# Altium project MCH_MAIN.PrjPcb (part 3 of 3)

## Sheet MB_watchdog_mcu.SchDoc
size A3
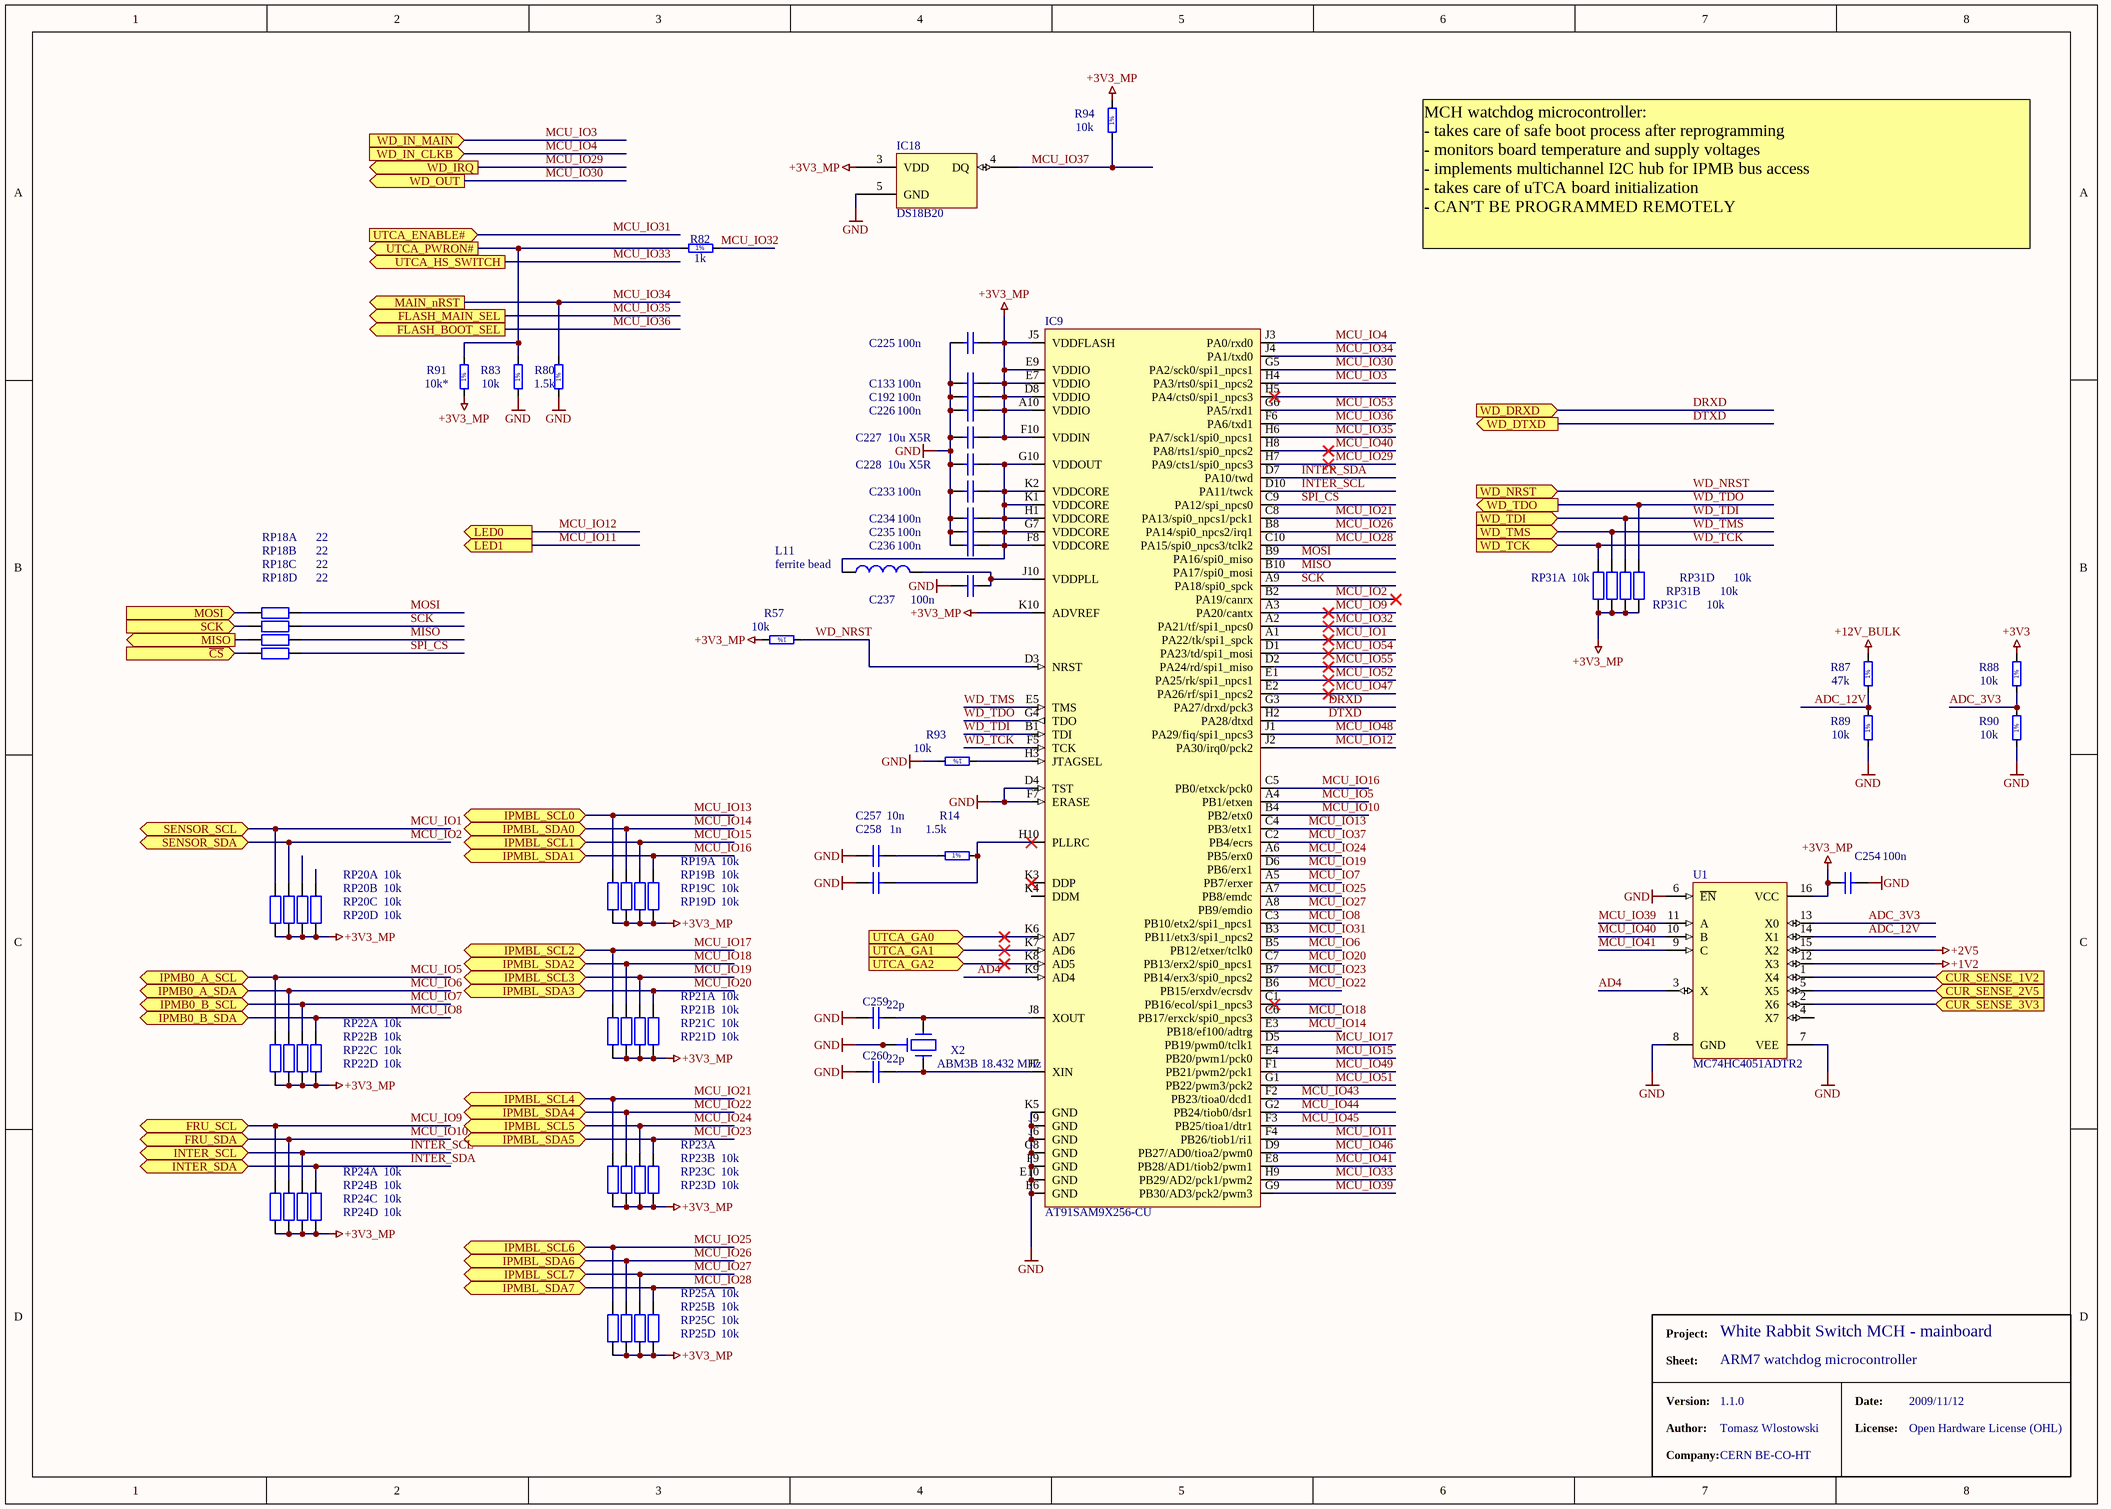
[diagram p9: MB_watchdog_mcu.SchDoc]

### Parts
C133  100n  [CAPC1005X55N]
C192  100n  [CAPC1005X55N]
C225  100n  [CAPC1005X55N]
C226  100n  [CAPC1005X55N]
C227  10u X5R  [CAPC1608X87N]
C228  10u X5R  [CAPC1608X87N]
C233  100n  [CAPC1005X55N]
C234  100n  [CAPC1005X55N]
C235  100n  [CAPC1005X55N]
C236  100n  [CAPC1005X55N]
C237  100n  [CAPC1005X55N]
C254  100n  [CAPC1005X55N]
C257  10n  [CAPC1005X55N]
C258  1n  [CAPC1005X55N]
C259  22p  [CAPC1005X55N]
C260  22p  [CAPC1005X55N]
IC9  AT91SAM9X256-CU  [TFBGA100x10]
IC18  DS18B20  [SOIC127P600-8AL]
L11  value ferrite bead  [INDC1608-0603]  (hidden comment: fer.bead)
R14  1.5k  [RESC1005X40N]
R57  10k  [RESC1005X40N]
R80  1.5k  [RESC1005X40N]
R82  1k  [RESC1005X40N]
R83  10k  [RESC1005X40N]
R87  47k  [RESC1005X40N]
R88  10k  [RESC1005X40N]
R89  10k  [RESC1005X40N]
R90  10k  [RESC1005X40N]
R91  10k*  [RESC1005X40N]
R93  10k  [RESC1005X40N]
R94  10k  [RESC1005X40N]
RP18  value 22  [YC124]  (hidden comment: 22R 0804)  (parts A,B,C,D of 4)
RP19  value 10k  [YC124]  (hidden comment: 10k 0804)  (parts A,B,C,D of 4)
RP20  value 10k  [YC124]  (hidden comment: 10k 0804)  (parts A,B,C,D of 4)
RP21  value 10k  [YC124]  (hidden comment: 10k 0804)  (parts A,B,C,D of 4)
RP22  value 10k  [YC124]  (hidden comment: 10k 0804)  (parts A,B,C,D of 4)
RP23  10k 0804  [YC124]  (value not drawn)  (parts A,B,C,D of 4)
RP24  value 10k  [YC124]  (hidden comment: 10k 0804)  (parts A,B,C,D of 4)
RP25  value 10k  [YC124]  (hidden comment: 10k 0804)  (parts A,B,C,D of 4)
RP31  value 10k  [YC124]  (hidden comment: 10k 0804)  (parts A,B,C,D of 4)
U1  MC74HC4051ADTR2  [948F-01]
X2  ABM3B 18.432 MHz  [XTALL_ABM3]

### Ports
CUR_SENSE_1V2 (in), CUR_SENSE_2V5 (in), CUR_SENSE_3V3 (in), FLASH_BOOT_SEL (out), FLASH_MAIN_SEL (out), FRU_SCL (bidir), FRU_SDA (bidir), INTER_SCL (bidir), INTER_SDA (bidir), IPMB0_A_SCL (bidir), IPMB0_A_SDA (bidir), IPMB0_B_SCL (bidir), IPMB0_B_SDA (bidir), IPMBL_SCL0 (bidir), IPMBL_SCL1 (bidir), IPMBL_SCL2 (bidir), IPMBL_SCL3 (bidir), IPMBL_SCL4 (bidir), IPMBL_SCL5 (bidir), IPMBL_SCL6 (bidir), IPMBL_SCL7 (bidir), IPMBL_SDA0 (bidir), IPMBL_SDA1 (bidir), IPMBL_SDA2 (bidir), IPMBL_SDA3 (bidir), IPMBL_SDA4 (bidir), IPMBL_SDA5 (bidir), IPMBL_SDA6 (bidir), IPMBL_SDA7 (bidir), LED0 (out), LED1 (out), MAIN_nRST (out), MISO (out), MOSI (in), SCK (in), SENSOR_SCL (bidir), SENSOR_SDA (bidir), UTCA_ENABLE# (in), UTCA_GA0 (in), UTCA_GA1 (in), UTCA_GA2 (in), UTCA_HS_SWITCH (out), UTCA_PWRON# (out), WD_DRXD (in), WD_DTXD (out), WD_IN_CLKB (in), WD_IN_MAIN (in), WD_IRQ (out), WD_NRST (in), WD_OUT (out), WD_TCK (in), WD_TDI (in), WD_TDO (out), WD_TMS (in), ~{CS} (in)

### Nets
+1V2: U1.12(X3)
+2V5: U1.15(X2)
+3V3: R88.2
+3V3_MP: C133.2 C192.2 C225.2 C226.2 C227.2 C254.1 IC9.A10(VDDIO) IC9.D8(VDDIO) IC9.E7(VDDIO) IC9.E9(VDDIO) IC9.F10(VDDIN) IC9.J5(VDDFLASH) IC9.K10(ADVREF) IC18.3(VDD) R57.2 R91.1 R94.2 RP19.1(A) RP19.2(A) RP19.3(A) RP19.4(A) RP20.1(A) RP20.2(A) RP20.3(A) RP20.4(A) RP21.1(A) RP21.2(A) RP21.3(A) RP21.4(A) RP22.1(A) RP22.2(A) RP22.3(A) RP22.4(A) RP23.1(A) RP23.2(A) RP23.3(A) RP23.4(A) RP24.1(A) RP24.2(A) RP24.3(A) RP24.4(A) RP25.1(A) RP25.2(A) RP25.3(A) RP25.4(A) RP31.1(A) RP31.2(A) RP31.3(A) RP31.4(A) U1.16(VCC)
+12V_BULK: R87.2
GND: C133.1 C192.1 C225.1 C226.1 C227.1 C228.1 C233.1 C234.1 C235.1 C236.1 C237.1 C254.2 C257.1 C258.1 C259.1 C260.1 IC9.D4(TST) IC9.E6(GND) IC9.E10(GND) IC9.F7(ERASE) IC9.F9(GND) IC9.G8(GND) IC9.J6(GND) IC9.J9(GND) IC9.K5(GND) IC18.5(GND) R80.1 R83.1 R89.1 R90.1 R93.2 U1.6(~{EN}) U1.7(VEE) U1.8(GND) X2.2 X2.4
AD4: IC9.K9(AD4) U1.3(X)
ADC_3V3: R88.1 R90.2 U1.13(X0)
ADC_12V: R87.1 R89.2 U1.14(X1)
CUR_SENSE_1V2: U1.1(X4) ; port CUR_SENSE_1V2
CUR_SENSE_2V5: U1.5(X5) ; port CUR_SENSE_2V5
CUR_SENSE_3V3: U1.2(X6) ; port CUR_SENSE_3V3
DRXD: IC9.G3(PA27/drxd/pck3) ; port WD_DRXD
DTXD: IC9.H2(PA28/dtxd) ; port WD_DTXD
INTER_SCL: IC9.D10(PA11/twck) RP24.5(B) ; port INTER_SCL
INTER_SDA: IC9.D7(PA10/twd) RP24.6(B) ; port INTER_SDA
MCU_IO1: IC9.A1(PA22/tk/spi1_spck) RP20.8(B) ; port SENSOR_SCL
MCU_IO2: IC9.B2(PA19/canrx) RP20.7(B) ; port SENSOR_SDA
MCU_IO3: IC9.H4(PA3/rts0/spi1_npcs2) ; port WD_IN_MAIN
MCU_IO4: IC9.J3(PA0/rxd0) ; port WD_IN_CLKB
MCU_IO5: IC9.A4(PB1/etxen) RP22.8(B) ; port IPMB0_A_SCL  [project net IPMB0_A_SCL]
MCU_IO6: IC9.B5(PB12/etxer/tclk0) RP22.7(B) ; port IPMB0_A_SDA  [project net IPMB0_A_SDA]
MCU_IO7: IC9.A5(PB7/erxer) RP22.6(B) ; port IPMB0_B_SCL  [project net IPMB0_B_SCL]
MCU_IO8: IC9.C3(PB10/etx2/spi1_npcs1) RP22.5(B) ; port IPMB0_B_SDA  [project net IPMB0_B_SDA]
MCU_IO9: IC9.A3(PA20/cantx) RP24.8(B) ; port FRU_SCL  [project net FRU_SCL]
MCU_IO10: IC9.B4(PB2/etx0) RP24.7(B) ; port FRU_SDA  [project net FRU_SDA]
MCU_IO11: IC9.F4(PB26/tiob1/ri1) ; port LED1  [project net FP_UTCA_LED1]
MCU_IO12: IC9.J2(PA30/irq0/pck2) ; port LED0  [project net FP_UTCA_LED0]
MCU_IO13: IC9.C4(PB3/etx1) RP19.8(B) ; port IPMBL_SCL0  [project net IPMBL_SCL0]
MCU_IO14: IC9.E3(PB18/ef100/adtrg) RP19.7(B) ; port IPMBL_SDA0  [project net IPMBL_SDA0]
MCU_IO15: IC9.E4(PB20/pwm1/pck0) RP19.6(B) ; port IPMBL_SCL1  [project net IPMBL_SCL1]
MCU_IO16: IC9.C5(PB0/etxck/pck0) RP19.5(B) ; port IPMBL_SDA1  [project net IPMBL_SDA1]
MCU_IO17: IC9.D5(PB19/pwm0/tclk1) RP21.8(B) ; port IPMBL_SCL2  [project net IPMBL_SCL2]
MCU_IO18: IC9.C6(PB17/erxck/spi0_npcs3) RP21.7(B) ; port IPMBL_SDA2  [project net IPMBL_SDA2]
MCU_IO19: IC9.D6(PB6/erx1) RP21.6(B) ; port IPMBL_SCL3  [project net IPMBL_SCL3]
MCU_IO20: IC9.C7(PB13/erx2/spi0_npcs1) RP21.5(B) ; port IPMBL_SDA3  [project net IPMBL_SDA3]
MCU_IO21: IC9.C8(PA13/spi0_npcs1/pck1) RP23.8(B) ; port IPMBL_SCL4  [project net IPMBL_SCL4]
MCU_IO22: IC9.B6(PB15/erxdv/ecrsdv) RP23.7(B) ; port IPMBL_SDA4  [project net IPMBL_SDA4]
MCU_IO23: IC9.B7(PB14/erx3/spi0_npcs2) RP23.5(B) ; port IPMBL_SDA5  [project net IPMBL_SDA5]
MCU_IO24: IC9.A6(PB5/erx0) RP23.6(B) ; port IPMBL_SCL5  [project net IPMBL_SCL5]
MCU_IO25: IC9.A7(PB8/emdc) RP25.8(B) ; port IPMBL_SCL6  [project net IPMBL_SCL6]
MCU_IO26: IC9.B8(PA14/spi0_npcs2/irq1) RP25.7(B) ; port IPMBL_SDA6  [project net IPMBL_SDA6]
MCU_IO27: IC9.A8(PB9/emdio) RP25.6(B) ; port IPMBL_SCL7  [project net IPMBL_SCL7]
MCU_IO28: IC9.C10(PA15/spi0_npcs3/tclk2) RP25.5(B) ; port IPMBL_SDA7  [project net IPMBL_SDA7]
MCU_IO29: IC9.H7(PA9/cts1/spi0_npcs3) ; port WD_IRQ
MCU_IO30: IC9.G5(PA2/sck0/spi1_npcs1) ; port WD_OUT
MCU_IO31: IC9.B3(PB11/etx3/spi1_npcs2) ; port UTCA_ENABLE#
MCU_IO32: IC9.A2(PA21/tf/spi1_npcs0) R82.2
MCU_IO33: IC9.H9(PB29/AD2/pck1/pwm2) ; port UTCA_HS_SWITCH  [project net FP_UTCA_HSWAPSW]
MCU_IO34: IC9.J4(PA1/txd0) R80.2 ; port MAIN_nRST  [project net MAIN_nRST]
MCU_IO35: IC9.H6(PA7/sck1/spi0_npcs1) ; port FLASH_MAIN_SEL  [project net FMAIN_SEL]
MCU_IO36: IC9.F6(PA6/txd1) ; port FLASH_BOOT_SEL  [project net FBOOT_SEL]
MCU_IO37: IC9.C2(PB4/ecrs) IC18.4(DQ) R94.1
MCU_IO39: IC9.G9(PB30/AD3/pck2/pwm3) U1.11(A)
MCU_IO40: IC9.H8(PA8/rts1/spi0_npcs2) U1.10(B)
MCU_IO41: IC9.E8(PB28/AD1/tiob2/pwm1) U1.9(C)
MCU_IO43: IC9.F2(PB23/tioa0/dcd1)
MCU_IO44: IC9.G2(PB24/tiob0/dsr1)
MCU_IO45: IC9.F3(PB25/tioa1/dtr1)
MCU_IO46: IC9.D9(PB27/AD0/tioa2/pwm0)
MCU_IO47: IC9.E2(PA26/rf/spi1_npcs2)
MCU_IO48: IC9.J1(PA29/fiq/spi1_npcs3)
MCU_IO49: IC9.F1(PB21/pwm2/pck1)
MCU_IO51: IC9.G1(PB22/pwm3/pck2)
MCU_IO52: IC9.E1(PA25/rk/spi1_npcs1)
MCU_IO53: IC9.G6(PA5/rxd1)
MCU_IO54: IC9.D1(PA23/td/spi1_mosi)
MCU_IO55: IC9.D2(PA24/rd/spi1_miso)
MISO: IC9.B10(PA17/spi0_mosi) RP18.6(B)
MOSI: IC9.B9(PA16/spi0_miso) RP18.8(B)
SCK: IC9.A9(PA18/spi0_spck) RP18.7(B)
SPI_CS: IC9.C9(PA12/spi_npcs0) RP18.5(B)
UTCA_GA0: IC9.K6(AD7) ; port UTCA_GA0
UTCA_GA1: IC9.K7(AD6) ; port UTCA_GA1
UTCA_GA2: IC9.K8(AD5) ; port UTCA_GA2
UTCA_PWRON#: R82.1 R83.2 R91.2 ; port UTCA_PWRON#
WD_CS: RP18.4(A) ; port ~{CS}
WD_MISO: RP18.3(A) ; port MISO
WD_MOSI: RP18.1(A) ; port MOSI
WD_NRST: IC9.D3(NRST) R57.1 ; port WD_NRST
WD_SCK: RP18.2(A) ; port SCK
WD_TCK: IC9.F5(TCK) RP31.8(B) ; port WD_TCK  [project net WD_JTAG_TCK]
WD_TDI: IC9.B1(TDI) RP31.5(B) ; port WD_TDI  [project net WD_JTAG_TDI]
WD_TDO: IC9.G4(TDO) RP31.7(B) ; port WD_TDO  [project net WD_JTAG_TDO]
WD_TMS: IC9.E5(TMS) RP31.6(B) ; port WD_TMS  [project net WD_JTAG_TMS]
NetC228_2: C228.2 C233.2 C234.2 C235.2 C236.2 IC9.F8(VDDCORE) IC9.G7(VDDCORE) IC9.G10(VDDOUT) IC9.H1(VDDCORE) IC9.K1(VDDCORE) IC9.K2(VDDCORE) L11.1
NetC237_2: C237.2 IC9.J10(VDDPLL) L11.2
NetC257_2: C257.2 R14.1
NetC258_2: C258.2 IC9.H10(PLLRC) R14.2
NetC259_2: C259.2 IC9.J8(XOUT) X2.1
NetC260_2: C260.2 IC9.J7(XIN) X2.3
NetIC9_H3: IC9.H3(JTAGSEL) R93.1

Not connected (* = marked no-connect by the designer): IC9 C1(PB16/ecol/spi1_npcs3)* H5(PA4/cts0/spi1_npcs3)* K3(DDP)* K4(DDM); RP20 5(B) 6(B); U1 4(X7)

### Notes on the sheet
- !
- MCH watchdog microcontroller:
  - takes care of safe boot process after reprogramming
  - monitors board temperature and supply voltages
  - implements multichannel I2C hub for IPMB bus access
  - takes care of uTCA board initialization
  - CAN'T BE PROGRAMMED REMOTELY
- Project:
- Sheet:
- ARM7 watchdog microcontroller
- White Rabbit Switch MCH - mainboard
- Version:
- Author:
- Company:
- 1.1.0
- Tomasz Wlostowski
- CERN BE-CO-HT
- Date:
- License:
- 2009/11/12
- Open Hardware License (OHL)
- (in symbol R0402_1K5_1%_0.0625W_100PPM) 1%
- (in symbol R0402_1K_1%_0.0625W_100PPM) 1%
- (in symbol R0402_10K_1%_0.0625W_100PPM) 1%
- (in symbol R0402_47K_1%_0.0625W_100PPM) 1%

### Library data of the parts
C133 C192 C225 C226 C233-C237 C254 = CC0402_100NF_16V_10%_X7R: Non-polarised capacitor; Part Description: SMD Multilayer Chip Ceramic Capacitor; Manufacturer: GENERIC; Manufacturer1 Part Number: 223878715649; Manufacturer1 Datasheet: \\cern.ch\dfs\Applications\Altium\Datasheets\CC0402_X7R_PHYCOMP.pdf; Value: 100nF; Voltage: 16V; TC: X7R; Tolerance: ±10%; Table: Capacitors SMD; Part Number: CC0402_100NF_16V_10%_X7R; Component Kind: Standard; Component Type: Standard; Designator: Capacitor - non polarized; Library Reference: Capacitor - non polarized; Pin Count: 2; Status: Not Recommended; Manufacturer Part Number: CC0402_100NF_16V_10%_X7R; Case: 0402; Mounted: Yes; Socket: No; SMD: Yes; Manufacturer1 Example: PHYCOMP; Manufacturer1 ComponentHeight: 0.55mm; HelpURL: \\cern.ch\dfs\Applications\Altium\Datasheets\CC0402_X7R_PHYCOMP.pdf; Author: CERN DEM JLC; CreateDate: 12/3/2007; LatestRevisionDate: 12/3/2007
C227 C228 = CC0603_10UF_6.3V_20%_X5R: Non-polarised capacitor; Part Description: SMD Multilayer Chip Ceramic Capacitor; Manufacturer: GENERIC; Manufacturer1 Part Number: C0603C106M9PAC; Manufacturer1 Datasheet: \\cern.ch\dfs\Applications\Altium\Datasheets\CC0603_X5R_KEMET.pdf; Value: 10uF; Voltage: 6.3V; Tolerance: ±20%; Table: Capacitors SMD; Part Number: CC0603_10UF_6.3V_20%_X5R; Component Kind: Standard; Component Type: Standard; Designator: Capacitor - non polarized; Library Reference: Capacitor - non polarized; Pin Count: 2; Status: Preferred; TC: X5R; Manufacturer Part Number: CC0603_10uF_6.3V_20%_X5R; Case: 0603; Mounted: Yes; Socket: No; SMD: Yes; Manufacturer1 Example: KEMET; Manufacturer1 ComponentHeight: 0.95mm; HelpURL: \\cern.ch\dfs\Applications\Altium\Datasheets\CC0603_X5R_KEMET.pdf; Author: CERN DEM JLC; CreateDate: 2007-12-03; LatestRevisionDate: 2007-12-03
C257 = CC0402_10NF_16V_10%_X7R: Non-polarised capacitor; Part Description: SMD Multilayer Chip Ceramic Capacitor; Manufacturer: GENERIC; Manufacturer1 Part Number: 223878715636; Manufacturer1 Datasheet: \\cern.ch\dfs\Applications\Altium\Datasheets\CC0402_X7R_PHYCOMP.pdf; Value: 10nF; Voltage: 16V; TC: X7R; Tolerance: ±10%; Table: Capacitors SMD; Part Number: CC0402_10NF_16V_10%_X7R; Component Kind: Standard; Component Type: Standard; Designator: Capacitor - non polarized; Library Reference: Capacitor - non polarized; Pin Count: 2; Status: Not Recommended; Manufacturer Part Number: CC0402_10NF_16V_10%_X7R; Case: 0402; Mounted: Yes; Socket: No; SMD: Yes; Manufacturer1 Example: PHYCOMP; Manufacturer1 ComponentHeight: 0.55mm; HelpURL: \\cern.ch\dfs\Applications\Altium\Datasheets\CC0402_X7R_PHYCOMP.pdf; Author: CERN DEM JLC; CreateDate: 2007-12-03; LatestRevisionDate: 2007-12-03
C258 = CC0402_1NF_50V_10%_X7R: Non-polarised capacitor; Part Description: SMD Multilayer Chip Ceramic Capacitor; Manufacturer: GENERIC; Manufacturer1 Part Number: 223858715623; Manufacturer1 Datasheet: \\cern.ch\dfs\Applications\Altium\Datasheets\CC0402_X7R_PHYCOMP.pdf; Value: 1nF; Voltage: 50V; TC: X7R; Tolerance: ±10%; Table: Capacitors SMD; Part Number: CC0402_1NF_50V_10%_X7R; Component Kind: Standard; Component Type: Standard; Designator: Capacitor - non polarized; Library Reference: Capacitor - non polarized; Pin Count: 2; Status: Not Recommended; Manufacturer Part Number: CC0402_1NF_50V_10%_X7R; Case: 0402; Mounted: Yes; Socket: No; SMD: Yes; Manufacturer1 Example: PHYCOMP; Manufacturer1 ComponentHeight: 0.55mm; HelpURL: \\cern.ch\dfs\Applications\Altium\Datasheets\CC0402_X7R_PHYCOMP.pdf; Author: CERN DEM JLC; CreateDate: 2007-12-03; LatestRevisionDate: 2007-12-03
C259 C260 = CC0402_22PF_50V_5%_NP0: Non-polarised capacitor; Part Description: SMD Multilayer Chip Ceramic Capacitor; Manufacturer: GENERIC; Manufacturer1 Part Number: 223886915229; Manufacturer1 Datasheet: \\cern.ch\dfs\Applications\Altium\Datasheets\CC0402_NP0_PHYCOMP.pdf; Value: 22pF; Voltage: 50V; TC: NP0; Tolerance: ±5%; Table: Capacitors SMD; Part Number: CC0402_22PF_50V_5%_NP0; Component Kind: Standard; Component Type: Standard; Designator: Capacitor - non polarized; Library Reference: Capacitor - non polarized; Pin Count: 2; Status: Not Recommended; Manufacturer Part Number: CC0402_22PF_50V_5%_NP0; Case: 0402; Mounted: Yes; Socket: No; SMD: Yes; Manufacturer1 Example: PHYCOMP; Manufacturer1 ComponentHeight: 0.55mm; HelpURL: \\cern.ch\dfs\Applications\Altium\Datasheets\CC0402_NP0_PHYCOMP.pdf; Author: CERN DEM JLC; CreateDate: 2007-12-03; LatestRevisionDate: 2007-12-03
IC9 = AT91SAM7X256: Atmel ARM7 microcontroller with 256kB flash; RefId: Mouser/556-A91SAM7X256CU
IC18 = DS18B20Z: 1-wire thermometer/ID chip; RefId: 1379772; Value: DS18B20Z; Supplier: Farnell
L11 = Inductor: Ferrite bead; Published: 8-Jun-2000; Revision: July-2002: Re-released for DXP Platform.; Publisher: Altium Limited
R14 = R0402_1K5_1%_0.0625W_100PPM: Resistor - 1%; Part Description: General Purpose Thick Film Chip Resistor; Manufacturer: GENERIC; Manufacturer1 Part Number: 232270671502; Manufacturer1 Datasheet: \\cern.ch\dfs\Applications\Altium\Datasheets\R0402_Phycomp_RC0402.pdf; Value: 1k5; TC: ±100ppm/°C; Table: Resistors SMD; Part Number: R0402_1K5_1%_0.0625W_100PPM; Component Kind: Standard; Component Type: Standard; Designator: Resistor - 1%; Library Reference: Resistor - 1%; Pin Count: 2; Status: Not recommended; Power: 0.0625W; Tolerance: ±1%; Manufacturer Part Number: R0402_1K5_1%_0.0625W_100PPM; Case: 0402; Mounted: Yes; Socket: No; SMD: Yes; Manufacturer1 Example: PHYCOMP; Manufacturer1 ComponentHeight: 0.4mm; HelpURL: \\cern.ch\dfs\Applications\Altium\Datasheets\R0402_Phycomp_RC0402.pdf; Author: CERN DEM JLC; CreateDate: 2007-12-03; LatestRevisionDate: 2008-03-13
R57 R83 R88-R90 R93 R94 = R0402_10K_1%_0.0625W_100PPM: as R103-R108 on sheet MB_power_supply; Part Number: R0402_10K_1%_0.0625W_100PPM; Component Kind: Standard; Component Type: Standard; Designator: Resistor - 1%; Library Reference: Resistor - 1%; Pin Count: 2; Value: 10k; Status: Not recommended; Power: 0.0625W; Tolerance: ±1%; Manufacturer Part Number: R0402_10K_1%_0.0625W_100PPM; Case: 0402; Mounted: Yes; Socket: No; SMD: Yes; Manufacturer1 Example: PHYCOMP; Manufacturer1 ComponentHeight: 0.4mm; HelpURL: \\cern.ch\dfs\Applications\Altium\Datasheets\R0402_Phycomp_RC0402.pdf; Author: CERN DEM JLC; CreateDate: 12/3/2007; LatestRevisionDate: 3/13/2008
R80 R91 = R0402_10K_1%_0.0625W_100PPM: Resistor - 1%; Part Description: General Purpose Thick Film Chip Resistor; Manufacturer: GENERIC; Manufacturer1 Part Number: 232270671003; Manufacturer1 Datasheet: \\cern.ch\dfs\Applications\Altium\Datasheets\R0402_Phycomp_RC0402.pdf; Value: 10k; TC: ±100ppm/°C; Table: Resistors SMD; Part Number: R0402_10K_1%_0.0625W_100PPM; Component Kind: Standard; Component Type: Standard; Designator: Resistor - 1%; Library Reference: Resistor - 1%; Pin Count: 2; Status: Not recommended; Power: 0.0625W; Tolerance: ±1%; Manufacturer Part Number: R0402_10K_1%_0.0625W_100PPM; Case: 0402; Mounted: Yes; Socket: No; SMD: Yes; Manufacturer1 Example: PHYCOMP; Manufacturer1 ComponentHeight: 0.4mm; HelpURL: \\cern.ch\dfs\Applications\Altium\Datasheets\R0402_Phycomp_RC0402.pdf; Author: CERN DEM JLC; CreateDate: 12/3/2007; LatestRevisionDate: 3/13/2008
R82 = R0402_1K_1%_0.0625W_100PPM: Resistor - 1%; Part Description: General Purpose Thick Film Chip Resistor; Manufacturer: GENERIC; Manufacturer1 Part Number: 232270671002; Manufacturer1 Datasheet: \\cern.ch\dfs\Applications\Altium\Datasheets\R0402_Phycomp_RC0402.pdf; TC: ±100ppm/°C; Table: Resistors SMD; Part Number: R0402_1K_1%_0.0625W_100PPM; Component Kind: Standard; Component Type: Standard; Designator: Resistor - 1%; Library Reference: Resistor - 1%; Pin Count: 2; Value: 1k; Status: Not recommended; Power: 0.0625W; Tolerance: ±1%; Manufacturer Part Number: R0402_1K_1%_0.0625W_100PPM; Case: 0402; Mounted: Yes; Socket: No; SMD: Yes; Manufacturer1 Example: PHYCOMP; Manufacturer1 ComponentHeight: 0.4mm; HelpURL: \\cern.ch\dfs\Applications\Altium\Datasheets\R0402_Phycomp_RC0402.pdf; Author: CERN DEM JLC; CreateDate: 2007-12-03; LatestRevisionDate: 2008-03-13
R87 = R0402_47K_1%_0.0625W_100PPM: Resistor - 1%; Part Description: General Purpose Thick Film Chip Resistor; Manufacturer: GENERIC; Manufacturer1 Part Number: 232270675103; Manufacturer1 Datasheet: \\cern.ch\dfs\Applications\Altium\Datasheets\R0402_Phycomp_RC0402.pdf; TC: ±100ppm/°C; Table: Resistors SMD; Part Number: R0402_47K_1%_0.0625W_100PPM; Component Kind: Standard; Component Type: Standard; Designator: Resistor - 1%; Library Reference: Resistor - 1%; Pin Count: 2; Value: 47k; Status: Not recommended; Power: 0.0625W; Tolerance: ±1%; Manufacturer Part Number: R0402_47K_1%_0.0625W_100PPM; Case: 0402; Mounted: Yes; Socket: No; SMD: Yes; Manufacturer1 Example: PHYCOMP; Manufacturer1 ComponentHeight: 0.4mm; HelpURL: \\cern.ch\dfs\Applications\Altium\Datasheets\R0402_Phycomp_RC0402.pdf; Author: CERN DEM JLC; CreateDate: 12/3/2007; LatestRevisionDate: 3/13/2008
RP18 = Res_Pack4_22R_YC124: 4-resistor pack; RefId: AVX  CRB2A4 series; Supplier: Farnell
RP19-RP25 RP31 = Res_Pack4_10k_YC124: 4-resistor pack; RefId: AVX  CRB2A4 series; Supplier: Farnell
U1 = MC74HC4051ADTR2: Analog Multiplexer/Demultiplexer; Published: 17-Jul-2002; LatestRevisionDate: 06-Jun-2005; LatestRevisionNote: Stylized 3D Model Added; DatasheetVersion: Mar-2000; PackageVersion: Mar-2000; PackageReference: 948F-01; Publisher: Altium Limited; PackageDescription: Shrink Small Outline; 16 Leads; Body Width 4.4 mm; Pitch 0.65 mm; ComponentLink1Description: Manufacturer Link; ComponentLink1URL: http://www.onsemi.com/site/products/parametrics/0,4446,47,00.html; ComponentLink2Description: Datasheet; ComponentLink2URL: http://www.onsemi.com/pub/Collateral/MC74HC4051A-D.PDF
X2 = X_CRYSTAL_SMD_ABM8: Miniature crystal oscillator (ABRACON); Value: ABM3B-18.432MHZ-B2-T; RefId: 1611814; Supplier: Farnell

## Nets that join several sheets
+1V2: MB_power_supply (6 pins), MB_watchdog_mcu (U1.12)
+2V5: MB_main (8 pins), MB_power_supply (19 pins), MB_watchdog_mcu (U1.15)
+3V3: MB_main (23 pins), MB_CPU_memory (43 pins), MB_power_supply (28 pins), MB_clocking (18 pins), MB_watchdog_mcu (R88.2)
+3V3_MP: MB_main (CN2.4 R92.1), MB_watchdog_mcu (50 pins)
+12V_BACKPLANE: MB_main (8 pins), MB_power_supply (F1.1)
+12V_BULK: MB_main (CN5.1 CN5.2 CN5.3 CN5.4), MB_power_supply (24 pins), MB_watchdog_mcu (R87.2)
GND: MB_main (113 pins), MB_CPU_memory (37 pins), MB_power_supply (89 pins), MB_clocking (15 pins), MB_watchdog_mcu (36 pins)
CUR_SENSE_1V2: MB_power_supply (IC21.6), MB_watchdog_mcu (U1.1)
CUR_SENSE_2V5: MB_power_supply (IC22.6), MB_watchdog_mcu (U1.5)
CUR_SENSE_3V3: MB_power_supply (IC24.6), MB_watchdog_mcu (U1.2)
DRXD: MB_main (CN7.15), MB_watchdog_mcu (IC9.G3)
DTXD: MB_main (CN7.13), MB_watchdog_mcu (IC9.H2)
FBOOT_SEL: MB_CPU_memory (IC8.1), MB_watchdog_mcu (IC9.F6)
FP_UTCA_HSWAPSW: MB_main (R92.2 S1.B S1.D), MB_watchdog_mcu (IC9.H9)
FP_UTCA_LED0: MB_main (RP30.8), MB_watchdog_mcu (IC9.J2)
FP_UTCA_LED1: MB_main (RP30.7), MB_watchdog_mcu (IC9.F4)
FRU_SCL: MB_main (CN2.130), MB_watchdog_mcu (IC9.A3 RP24.8)
FRU_SDA: MB_main (CN2.129), MB_watchdog_mcu (IC9.B4 RP24.7)
INTER_SCL: MB_main (CN2.56), MB_watchdog_mcu (IC9.D10 RP24.5)
INTER_SDA: MB_main (CN2.71), MB_watchdog_mcu (IC9.D7 RP24.6)
IPMB0_A_SCL: MB_main (CN2.127), MB_watchdog_mcu (IC9.A4 RP22.8)
IPMB0_A_SDA: MB_main (CN2.126), MB_watchdog_mcu (IC9.B5 RP22.7)
IPMB0_B_SCL: MB_main (CN2.124), MB_watchdog_mcu (IC9.A5 RP22.6)
IPMB0_B_SDA: MB_main (CN2.123), MB_watchdog_mcu (IC9.C3 RP22.5)
IPMBL_SCL0: MB_main (CN2.121), MB_watchdog_mcu (IC9.C4 RP19.8)
IPMBL_SCL1: MB_main (CN2.118), MB_watchdog_mcu (IC9.E4 RP19.6)
IPMBL_SCL2: MB_main (CN2.115), MB_watchdog_mcu (IC9.D5 RP21.8)
IPMBL_SCL3: MB_main (CN2.112), MB_watchdog_mcu (IC9.D6 RP21.6)
IPMBL_SCL4: MB_main (CN2.109), MB_watchdog_mcu (IC9.C8 RP23.8)
IPMBL_SCL5: MB_main (CN2.106), MB_watchdog_mcu (IC9.A6 RP23.6)
IPMBL_SCL6: MB_main (CN2.103), MB_watchdog_mcu (IC9.A7 RP25.8)
IPMBL_SCL7: MB_main (CN2.100), MB_watchdog_mcu (IC9.A8 RP25.6)
IPMBL_SDA0: MB_main (CN2.120), MB_watchdog_mcu (IC9.E3 RP19.7)
IPMBL_SDA1: MB_main (CN2.117), MB_watchdog_mcu (IC9.C5 RP19.5)
IPMBL_SDA2: MB_main (CN2.114), MB_watchdog_mcu (IC9.C6 RP21.7)
IPMBL_SDA3: MB_main (CN2.111), MB_watchdog_mcu (IC9.C7 RP21.5)
IPMBL_SDA4: MB_main (CN2.108), MB_watchdog_mcu (IC9.B6 RP23.7)
IPMBL_SDA5: MB_main (CN2.105), MB_watchdog_mcu (IC9.B7 RP23.5)
IPMBL_SDA6: MB_main (CN2.102), MB_watchdog_mcu (IC9.B8 RP25.7)
IPMBL_SDA7: MB_main (CN2.99), MB_watchdog_mcu (IC9.C10 RP25.5)
MCU_IO4: MB_main (CN4.5), MB_watchdog_mcu (IC9.J3)
MCU_IO30: MB_main (CN4.3), MB_watchdog_mcu (IC9.G5)
MCU_IO31: MB_main (CN2.41), MB_watchdog_mcu (IC9.B3)
NetIC10_12: MB_main (R74.2), MB_CPU_memory (IC10.12)
REFCLK_MAIN+: MB_main (CN11.3), MB_clocking (IC1.2 R10.1)
REFCLK_MAIN-: MB_main (CN11.5), MB_clocking (IC1.3 R10.2)
UTCA_GA0: MB_main (CN2.5), MB_watchdog_mcu (IC9.K6)
UTCA_GA1: MB_main (CN2.17), MB_watchdog_mcu (IC9.K7)
UTCA_GA2: MB_main (CN2.26), MB_watchdog_mcu (IC9.K8)
UTCA_PWRON#: MB_main (CN2.170 CN7.12), MB_watchdog_mcu (R82.1 R83.2 R91.2)
WD_JTAG_TCK: MB_main (CN7.17), MB_watchdog_mcu (IC9.F5 RP31.8)
WD_JTAG_TDI: MB_main (CN7.21), MB_watchdog_mcu (IC9.B1 RP31.5)
WD_JTAG_TDO: MB_main (CN7.25), MB_watchdog_mcu (IC9.G4 RP31.7)
WD_JTAG_TMS: MB_main (CN7.19), MB_watchdog_mcu (IC9.E5 RP31.6)
WD_NRST: MB_main (CN7.23), MB_watchdog_mcu (IC9.D3 R57.1)